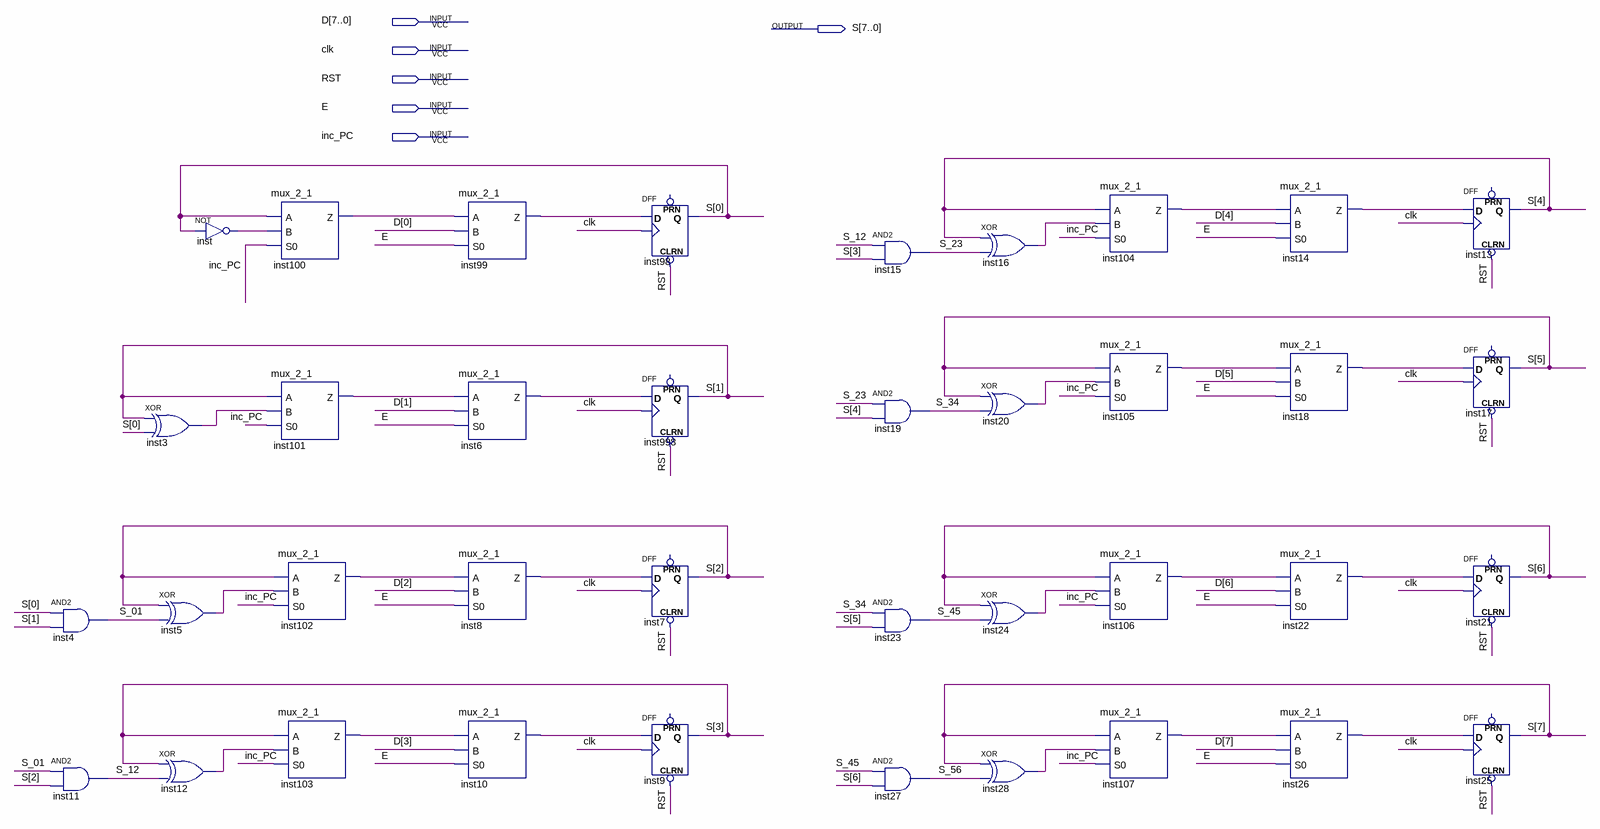
[diagram p0: schematic sheet]
// Quartus schematic REG_PC_8b.bdf as structural Verilog: 38 symbols, 6 pins
module REG_PC_8b (
  input  [7:0] D,
  input  clk,
  input  RST,
  input  E,
  input  inc_PC,
  output [7:0] S
);

  wire inst3_out, inst5_out, inst6_z, inst8_z, inst10_z, inst12_out, inst14_z, inst16_out, inst18_z,
       inst20_out, inst22_z, inst24_out, inst26_z, inst28_out, inst99_z, inst100_z, inst101_z, inst102_z,
       inst103_z, inst104_z, inst105_z, inst106_z, inst107_z, inst_out, S_01, S_12, S_23, S_34, S_45, S_56;

  and inst4 (S_01, S[0], S[1]);
  and inst11 (S_12, S_01, S[2]);
  not inst (inst_out, S[0]);
  xor inst3 (inst3_out, S[1], S[0]);
  xor inst5 (inst5_out, S[2], S_01);
  xor inst12 (inst12_out, S[3], S_12);
  mux_2_1 inst100 (.A(S[0]), .B(inst_out), .S0(inc_PC), .Z(inst100_z));
  mux_2_1 inst101 (.A(S[1]), .B(inst3_out), .S0(inc_PC), .Z(inst101_z));
  mux_2_1 inst102 (.A(S[2]), .B(inst5_out), .S0(inc_PC), .Z(inst102_z));
  mux_2_1 inst103 (.A(S[3]), .B(inst12_out), .S0(inc_PC), .Z(inst103_z));
  mux_2_1 inst99 (.A(inst100_z), .B(D[0]), .S0(E), .Z(inst99_z));
  mux_2_1 inst6 (.A(inst101_z), .B(D[1]), .S0(E), .Z(inst6_z));
  mux_2_1 inst8 (.A(inst102_z), .B(D[2]), .S0(E), .Z(inst8_z));
  mux_2_1 inst10 (.A(inst103_z), .B(D[3]), .S0(E), .Z(inst10_z));
  DFF inst98 (.CLRN(RST), .CLK(clk), .D(inst99_z), .Q(S[0]));  // open: PRN
  DFF inst998 (.CLRN(RST), .CLK(clk), .D(inst6_z), .Q(S[1]));  // open: PRN
  DFF inst7 (.CLRN(RST), .CLK(clk), .D(inst8_z), .Q(S[2]));  // open: PRN
  DFF inst9 (.CLRN(RST), .CLK(clk), .D(inst10_z), .Q(S[3]));  // open: PRN
  and inst15 (S_23, S_12, S[3]);
  and inst19 (S_34, S_23, S[4]);
  and inst23 (S_45, S_34, S[5]);
  and inst27 (S_56, S_45, S[6]);
  xor inst16 (inst16_out, S[4], S_23);
  xor inst20 (inst20_out, S[5], S_34);
  xor inst24 (inst24_out, S[6], S_45);
  xor inst28 (inst28_out, S[7], S_56);
  mux_2_1 inst104 (.A(S[4]), .B(inst16_out), .S0(inc_PC), .Z(inst104_z));
  mux_2_1 inst105 (.A(S[5]), .B(inst20_out), .S0(inc_PC), .Z(inst105_z));
  mux_2_1 inst106 (.A(S[6]), .B(inst24_out), .S0(inc_PC), .Z(inst106_z));
  mux_2_1 inst107 (.A(S[7]), .B(inst28_out), .S0(inc_PC), .Z(inst107_z));
  mux_2_1 inst14 (.A(inst104_z), .B(D[4]), .S0(E), .Z(inst14_z));
  mux_2_1 inst18 (.A(inst105_z), .B(D[5]), .S0(E), .Z(inst18_z));
  mux_2_1 inst22 (.A(inst106_z), .B(D[6]), .S0(E), .Z(inst22_z));
  mux_2_1 inst26 (.A(inst107_z), .B(D[7]), .S0(E), .Z(inst26_z));
  DFF inst13 (.CLRN(RST), .CLK(clk), .D(inst14_z), .Q(S[4]));  // open: PRN
  DFF inst17 (.CLRN(RST), .CLK(clk), .D(inst18_z), .Q(S[5]));  // open: PRN
  DFF inst21 (.CLRN(RST), .CLK(clk), .D(inst22_z), .Q(S[6]));  // open: PRN
  DFF inst25 (.CLRN(RST), .CLK(clk), .D(inst26_z), .Q(S[7]));  // open: PRN
endmodule
